# EAGLE design Control_Board (EAGLE 9.4.0)
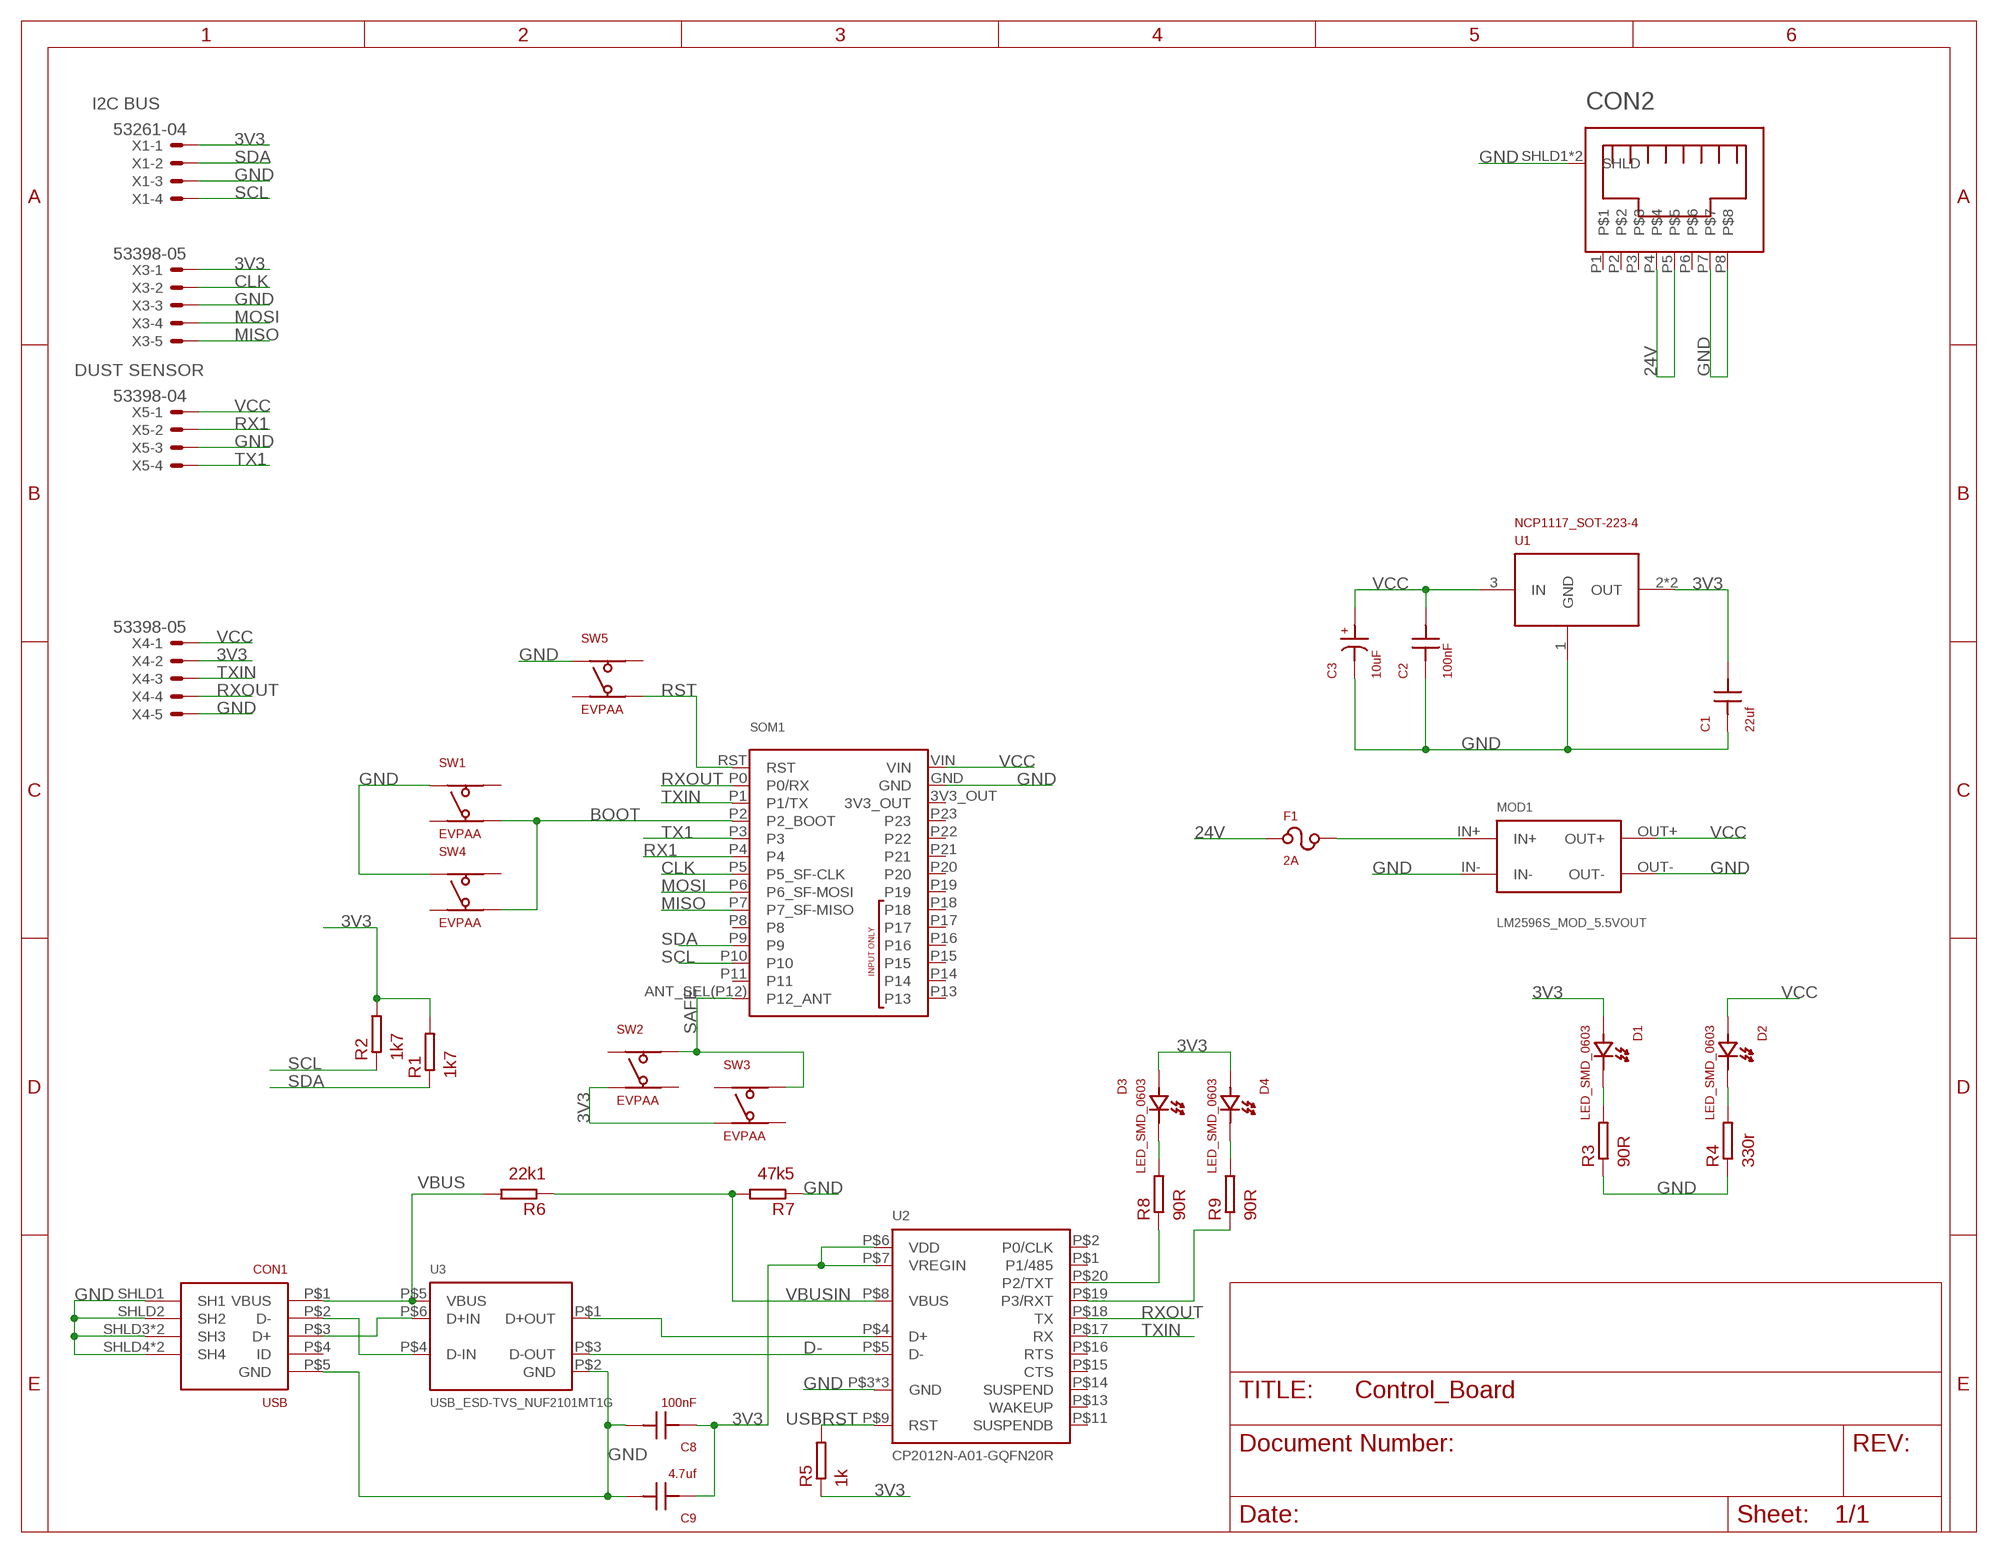
[diagram p0: schematic, sheet 1]

## Parts
C1  22uf  CAP_NP_0603  [SMD_0603]
C2  100nF  CAP_NP_0603  [SMD_0603]
C3  10uF  CAP_POL_SMD_1206  [CAP_POL_1206]
C8  100nF  CAP_NP_0603  [SMD_0603]
C9  4.7uf  CAP_NP_0603  [SMD_0603]
CON1  USB  [USB_MICRO_B_SMD_AMPHENOL]
CON2  P-RJLSE-4X381-01_AMPHENOL  [P-RJLSE-4X381-01_AMPHENOL_SMD_RJ45]
D1  LED_SMD_0603  [LED_SMD_0603]
D2  LED_SMD_0603  [LED_SMD_0603]
D3  LED_SMD_0603  [LED_SMD_0603]
D4  LED_SMD_0603  [LED_SMD_0603]
F1  2A  FUSE_CLIP_SMD_AUTO_MINI_LOWPROF  [FUSE_SMD_AUTO_MINI_LOWPROF]
MOD1  LM2596S_MOD_5.5VOUT  LM2596S-BUCK_CVTR-MODULE  [LM2596S_MODULE]
R1  1k7  RESISTOR_0603  [SMD_0603]
R2  1k7  RESISTOR_0603  [SMD_0603]
R3  90R  RESISTOR_0603  [SMD_0603]
R4  330r  RESISTOR_0603  [SMD_0603]
R5  1k  RESISTOR_0603  [SMD_0603]
R6  22k1  RESISTOR_0603  [SMD_0603]
R7  47k5  RESISTOR_0603  [SMD_0603]
R8  90R  RESISTOR_0603  [SMD_0603]
R9  90R  RESISTOR_0603  [SMD_0603]
SOM1  PYCOM_LOPY4PTH  [PYCOM_LOPY4_PTH]
SW1  EVPAA  SWITCH_MOM_PANA_EVPAA_3.5X2.9  [EVPAA_SWITCH]
SW2  EVPAA  SWITCH_MOM_PANA_EVPAA_3.5X2.9  [EVPAA_SWITCH]
SW3  EVPAA  SWITCH_MOM_PANA_EVPAA_3.5X2.9  [EVPAA_SWITCH]
SW4  EVPAA  SWITCH_MOM_PANA_EVPAA_3.5X2.9  [EVPAA_SWITCH]
SW5  EVPAA  SWITCH_MOM_PANA_EVPAA_3.5X2.9  [EVPAA_SWITCH]
U1  NCP1117_SOT-223-4  [SOT-223]
U2  CP2012N-A01-GQFN20R  [QFN20]
U3  USB_ESD-TVS_NUF2101MT1G  [TSOP-6]
X1  53261-04  [53261-04]
X3  53398-05  [53398-05]
X4  53398-05  [53398-05]
X5  53398-04  [53398-04]

## Nets
3V3: C1.P$2 C8.P$1 C9.P$1 D1.A D3.A D4.A R1.P$2 R2.P$2 R5.P$1 SW2.P$1(A1) SW3.P$1(A1) U1.2(OUT) U1.4(OUT) U2.P$6(VDD) U2.P$7(VREGIN) X1.1 X3.1 X4.2
24V: CON2.P4 CON2.P5 F1.P1A F1.P1B
BOOT: SOM1.P2(P2_BOOT) SW1.P$1'(A2) SW4.P$1'(A2)
CLK: SOM1.P5(P5_SF-CLK) X3.2
D-: U2.P$5(D-) U3.P$3(D-OUT)
GND: C1.P$1 C2.P$1 C3.N C8.P$2 C9.P$2 CON1.P$5(GND) CON1.SHLD1(SH1) CON1.SHLD2(SH2) CON1.SHLD3(SH3) CON1.SHLD4(SH4) CON1.SHLD5(SH3) CON1.SHLD6(SH4) CON2.P7 CON2.P8 CON2.SHLD1(SHLD) CON2.SHLD2(SHLD) MOD1.IN- MOD1.OUT- R3.P$1 R4.P$1 R7.P$1 SOM1.GND SW1.P$2(B1) SW4.P$2(B1) SW5.P$2(B1) U1.1(GND) U2.P$3(GND) U2.P$12(GND) U2.PAD(GND) U3.P$2(GND) X1.3 X3.3 X4.5 X5.3
MISO: SOM1.P7(P7_SF-MISO) X3.5
MOSI: SOM1.P6(P6_SF-MOSI) X3.4
N$1: F1.P2A F1.P2B MOD1.IN+
N$3: CON1.P$3(D+) U3.P$6(D+IN)
N$4: U2.P$4(D+) U3.P$1(D+OUT)
N$5: CON1.P$2(D-) U3.P$4(D-IN)
N$6: D3.K R8.P$2
N$7: D4.K R9.P$2
N$8: R9.P$1 U2.P$19(P3/RXT)
N$9: R8.P$1 U2.P$20(P2/TXT)
N$11: D1.K R3.P$2
N$12: D2.K R4.P$2
RST: SOM1.RST SW5.P$1'(A2)
RX1: SOM1.P4 X5.2
RXOUT: SOM1.P0(P0/RX) U2.P$18(TX) X4.4
SAFE: SOM1.ANT_SEL(P12)(P12_ANT) SW2.P$2'(B2) SW3.P$2'(B2)
SCL: R2.P$1 SOM1.P10 X1.4
SDA: R1.P$1 SOM1.P9 X1.2
TX1: SOM1.P3 X5.4
TXIN: SOM1.P1(P1/TX) U2.P$17(RX) X4.3
USBRST: R5.P$2 U2.P$9(RST)
VBUS: CON1.P$1(VBUS) R6.P$2 U3.P$5(VBUS)
VBUSIN: R6.P$1 R7.P$2 U2.P$8(VBUS)
VCC: C2.P$2 C3.P D2.A MOD1.OUT+ SOM1.VIN U1.3(IN) X4.1 X5.1
Unconnected: CON1.P$4(ID) CON2.P1 CON2.P2 CON2.P3 CON2.P6 SOM1.P8 SOM1.P11 SOM1.P13 SOM1.P14 SOM1.P15 SOM1.P16 SOM1.P17 SOM1.P18 SOM1.P19 SOM1.P20 SOM1.P21 SOM1.P22 SOM1.P23 SW1.P$1(A1) SW1.P$2'(B2) SW2.P$1'(A2) SW2.P$2(B1) SW3.P$1'(A2) SW3.P$2(B1) SW4.P$1(A1) SW4.P$2'(B2) SW5.P$1(A1) SW5.P$2'(B2) U2.P$1(P1/485) U2.P$2(P0/CLK) U2.P$11(SUSPENDB) U2.P$13(WAKEUP) U2.P$14(SUSPEND) U2.P$15(CTS) U2.P$16(RTS)

## Notes on the sheet
- I2C BUS
- DUST SENSOR

## Power pins joined to a net without a drawn wire
3V3_OUT: SOM1.3V3_OUT

## Library data of the parts
C1 C2 C8 C9 = daneagle_db8.0:CAP_NP
C3 = daneagle_db8.0:CAP_POL
CON1 = daneagle_db8.0:USB
CON2 = daneagle_db8.0:P-RJLSE-4X381-01
D1-D4 = daneagle_db8.0:LED
F1 = daneagle_db8.0:FUSE
MOD1 = daneagle_db8.0:LM2596S-BUCK_CVTR-MODULE
R1-R9 = daneagle_db8.0:RESISTOR
SOM1 = daneagle_db8.0:PYCOM_LOPY4
SW1-SW5 = daneagle_db8.0:SWITCH_MOM
U1 = daneagle_db8.0:NCP1117
U2 = daneagle_db8.0:CP2012N
U3 = daneagle_db8.0:USB_ESD-TVS
X1 = con-molex:53?-04: CONNECTOR wire to board 1.25 mm (.049 inch) pitch header; MF: MOLEX; OC_FARNELL: 1125374; OC_NEWARK: unknown
X3 X4 = con-molex:53?-05: CONNECTOR wire to board 1.25 mm (.049 inch) pitch header; MF: MOLEX; OC_FARNELL: 1125354; OC_NEWARK: unknown
X5 = con-molex:53?-04: CONNECTOR wire to board 1.25 mm (.049 inch) pitch header; MF: MOLEX; OC_FARNELL: 1125367; OC_NEWARK: unknown

## Board
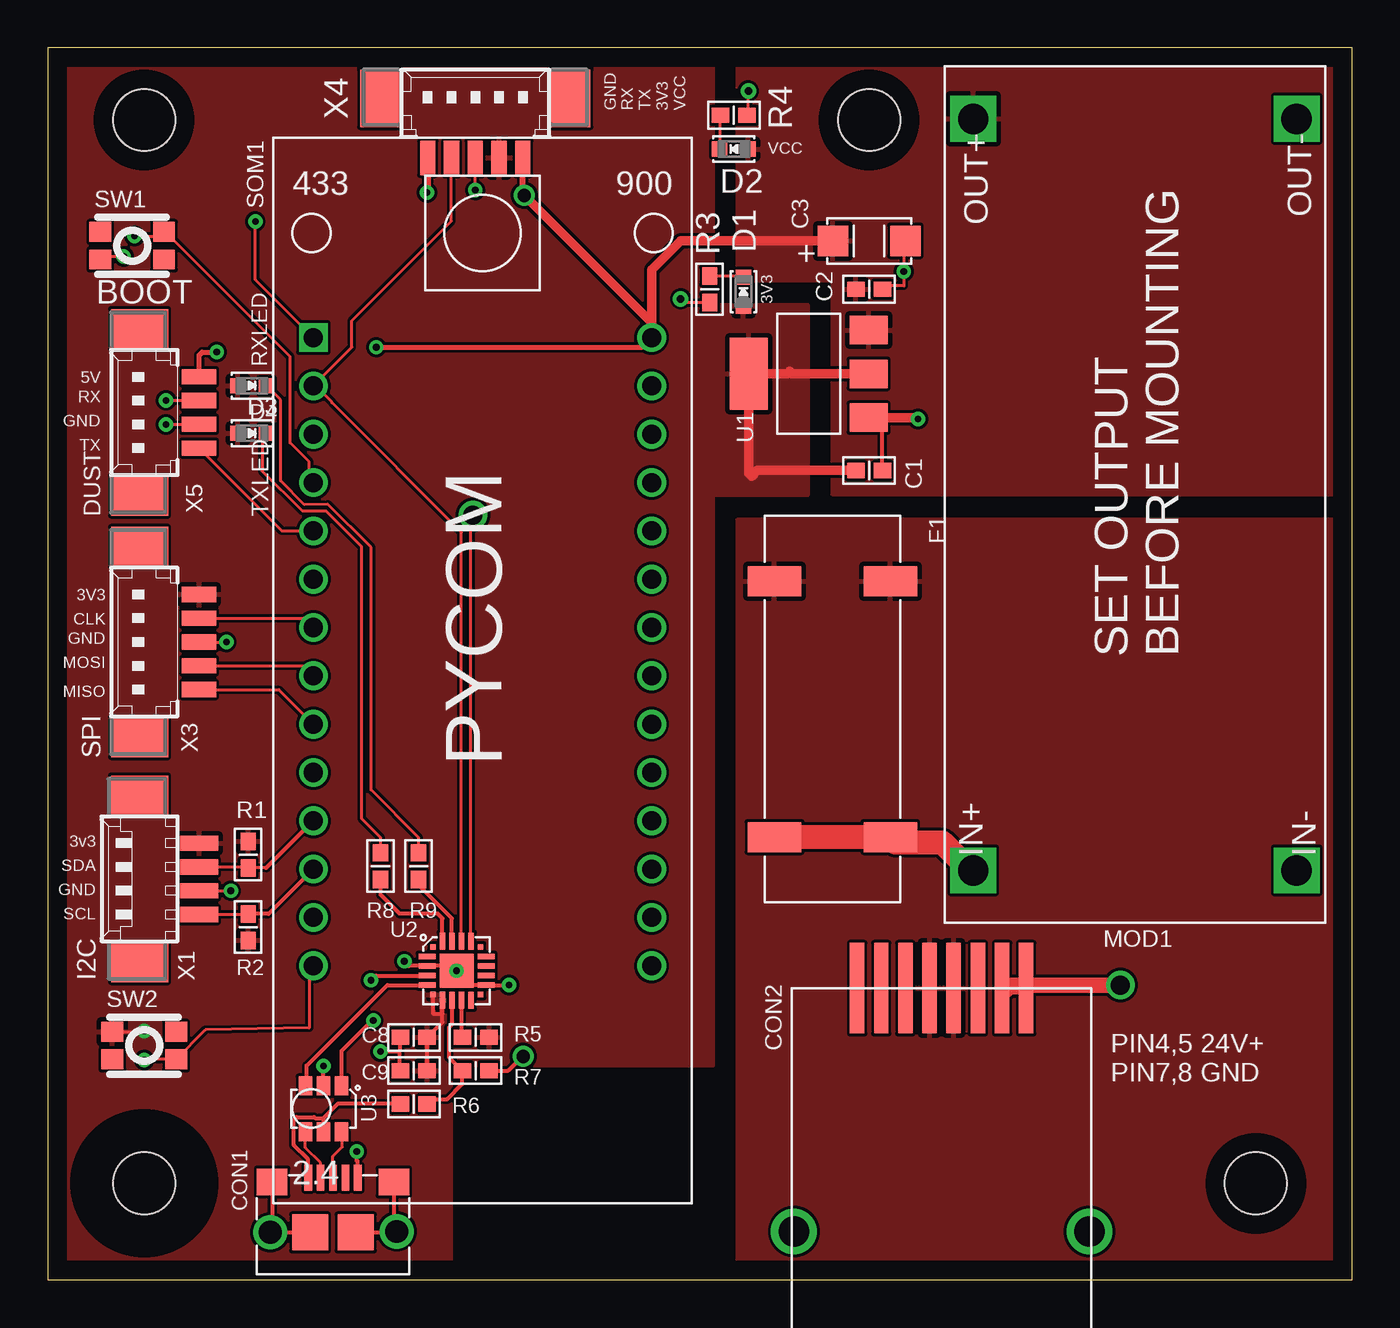
[diagram p1: board, top side]
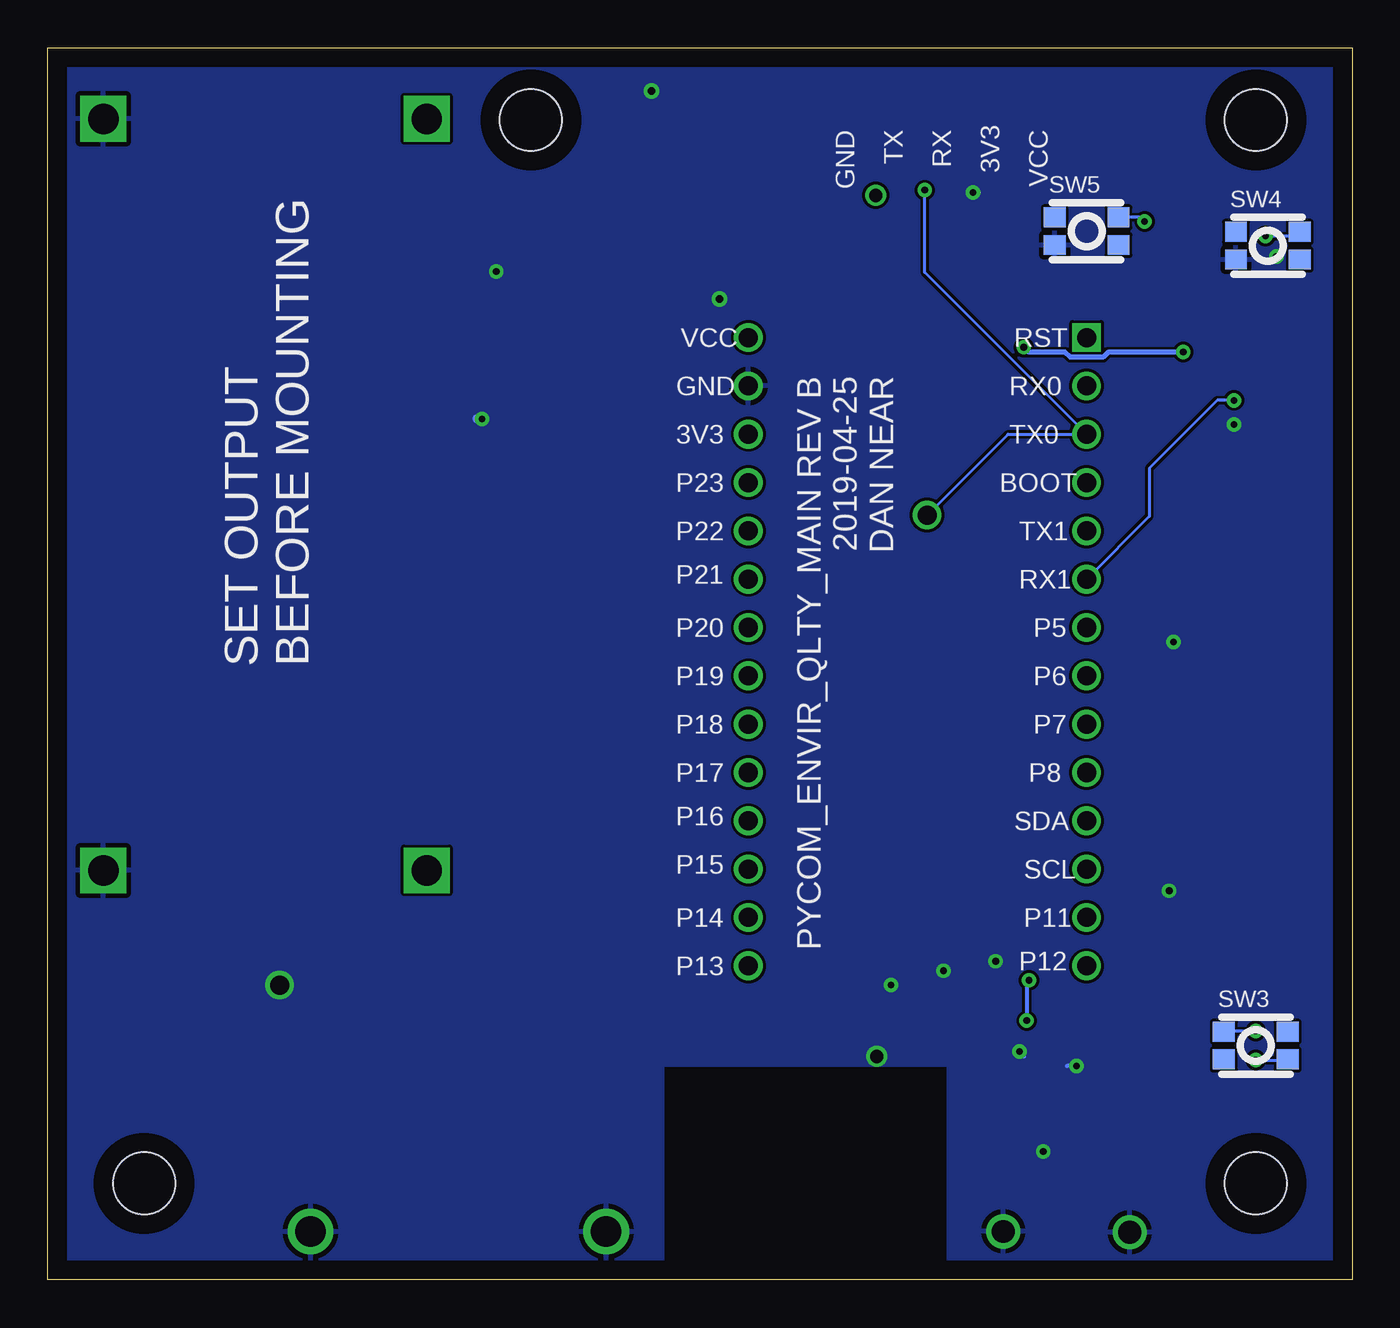
[diagram p2: board, bottom side, seen from below]

Size 68.58 x 64.77 mm. Coordinates in mm from the lower left corner, seen from the top.
Outline: 0,0 68.58,0 68.58,64.77 0,64.77 0,0
Copper layers (1*16): Top 0.035mm / dielectric 1.5mm / Bottom 0.035mm
Design rules "default": minimum track width 6mil, minimum drill 0.35mm, track to track 6mil, track to pad 6mil, pad to pad 6mil, via to via 6mil, smd to smd 6mil, copper to edge 40mil, drill to drill 6mil, minimum pad ring 10mil, minimum via ring 8mil, stop-mask expansion 4mil, vias tented up to drill 0mil, thermal gap 10mil
Holes 3.25 mm at 5.08,5.08 5.08,60.96 63.5,5.08 43.18,60.96
tKeepout: area 60,1.6 to 67,8.6; area 1.6,57.5 to 8.6,64.5; area 39.6,57.5 to 46.6,64.5
tRestrict: area 1.3,1.3 to 8.9,8.9

### Footprints (pad centres in the part's own frame; a part is rotated, then mirrored left to right if it is on the bottom)
SMD_0603 = smd 0.914 x 0.8: P$1 -0.701,0; P$2 0.701,0
CAP_POL_1206 = smd 1.6 x 1.6: N 1.9,0; P -1.9,0
USB_MICRO_B_SMD_AMPHENOL = smd 0.4 x 1.35: P$1 -1.3,2.875; P$2 -0.65,2.875; P$3 0,2.875; P$4 0.65,2.875; P$5 1.3,2.875 | smd 1.9 x 1.9: SHLD1 -1.2,0; SHLD2 1.2,0 | drill 1.2: SHLD3 -3.3,0; SHLD4 3.35,0.05 | smd 1.6 x 1.4: SHLD5 -3.2,2.65; SHLD6 3.2,2.65
P-RJLSE-4X381-01_AMPHENOL_SMD_RJ45 = smd 0.76 x 4.75: P1 -4.445,12.8; P2 -3.175,12.8; P3 -1.905,12.8; P4 -0.635,12.8; P5 0.635,12.8; P6 1.905,12.8; P7 3.175,12.8; P8 4.445,12.8 | drill 1.6: SHLD1 -7.77,0; SHLD2 7.77,0
LED_SMD_0603 = smd 0.8 x 0.8: A 0.75,0; K -0.75,0
FUSE_SMD_AUTO_MINI_LOWPROF = smd 1.575 x 2.819: P1A -6.731,3.048; P1B -6.731,-3.048; P2A 6.731,3.048; P2B 6.731,-3.048
LM2596S_MODULE = drill 1.6 square: IN+ -19.75,8.5; IN- -19.75,-8.5; OUT+ 19.75,8.5; OUT- 19.75,-8.5
PYCOM_LOPY4_PTH = drill 1: 3V3_OUT 8.89,11.43; ANT_SEL(P12) -8.89,-16.51; GND 8.89,13.97; P0 -8.89,13.97; P1 -8.89,11.43; P2 -8.89,8.89; P3 -8.89,6.35; P4 -8.89,3.81; P5 -8.89,1.27; P6 -8.89,-1.27; P7 -8.89,-3.81; P8 -8.89,-6.35; P9 -8.89,-8.89; P10 -8.89,-11.43; P11 -8.89,-13.97; P13 8.89,-16.51; P14 8.89,-13.97; P15 8.89,-11.43; P16 8.89,-8.89; P17 8.89,-6.35; P18 8.89,-3.81; P19 8.89,-1.27; P20 8.89,1.27; P21 8.89,3.81; P22 8.89,6.35; P23 8.89,8.89; VIN 8.89,16.51 | drill 1 square: RST -8.89,16.51
EVPAA_SWITCH = smd 1.15 x 1.05: P$1 -1.675,0.725; P$1' 1.675,0.725; P$2 -1.675,-0.725; P$2' 1.675,-0.725
SOT-223 = smd 1.5 x 2: 1 -2.3,-3.15; 2 0,-3.15; 3 2.3,-3.15 | smd 3.8 x 2: 4 0,3.15
QFN20 = smd 0.3 x 0.3: P$1 -1.25,1.25; P$6 -1.25,-1.25; P$11 1.25,-1.25; P$16 1.25,1.25 | smd 0.9 x 0.3: P$2 -1.55,0.75; P$3 -1.55,0.25; P$4 -1.55,-0.25; P$5 -1.55,-0.75; P$12 1.55,-0.75; P$13 1.55,-0.25; P$14 1.55,0.25; P$15 1.55,0.75 | smd 0.3 x 0.9: P$7 -0.75,-1.55; P$8 -0.25,-1.55; P$9 0.25,-1.55; P$10 0.75,-1.55; P$17 0.75,1.55; P$18 0.25,1.55; P$19 -0.25,1.55; P$20 -0.75,1.55 | smd 1.8 x 1.8: PAD 0,0
TSOP-6 = smd 1 x 0.7: P$1 -1.2,0.95; P$2 -1.2,0; P$3 -1.2,-0.95; P$4 1.2,-0.95; P$5 1.2,0; P$6 1.2,0.95
53261-04 = smd 0.8 x 2: 1 1.875,-2.5; 2 0.625,-2.5; 3 -0.625,-2.5; 4 -1.875,-2.5 | smd 2.1 x 3: S1 4.375,0.625; S2 -4.375,0.625
53398-05 = smd 0.8 x 1.8: 1 2.5,-2.5; 2 1.25,-2.5; 3 0,-2.5; 4 -1.25,-2.5; 5 -2.5,-2.5 | smd 2.1 x 3: S1 5,0.625; S2 -5,0.625
53398-04 = smd 0.8 x 1.8: 1 1.875,-2.5; 2 0.625,-2.5; 3 -0.625,-2.5; 4 -1.875,-2.5 | smd 2.1 x 3: S1 4.375,0.625; S2 -4.375,0.625

### Placement (x,y rotation side)
C1  43.18,42.55 180 top
C2  43.18,52.07 180 top
C3  43.18,54.61 0 top
C8  19.25,12.75 180 top
C9  19.25,11 180 top
CON1  15,2.5 0 top
CON2  46.99,2.54 0 top
D1  36.58,51.94 270 top
D2  36.07,59.44 0 top
D3  10.75,44.5 180 top
D4  10.75,47 180 top
F1  41.25,30 270 top
MOD1  57.15,41.27 90 top
R1  10.54,22.35 90 top
R2  10.54,18.54 270 top
R3  34.8,52.07 90 top
R4  36.07,61.21 180 top
R5  22.5,12.75 180 top
R6  19.25,9.25 180 top
R7  22.5,11 180 top
R8  17.5,21.75 90 top
R9  19.5,21.75 90 top
SOM1  22.86,33.02 0 top
SW1  4.45,54.36 0 top
SW2  5.08,12.32 0 top
SW3  5.08,12.32 0 bottom
SW4  4.45,54.36 0 bottom
SW5  13.97,55.12 0 bottom
U1  40.01,47.62 90 top
U2  21.5,16.25 0 top
U3  14.5,9 270 top
X1  5.46,21.08 90 top
X3  5.46,33.53 90 top
X4  22.48,61.47 0 top
X5  5.46,45.59 90 top

### Tracks (layer width: path | path; a pad name or v marks a point on that pad's centre or on a via)
3V3  (via drill 0.35)
  Top 0.152: 40,47.75 43,47.75 U1.2 | SW2.P$1 5.04,13.04 v5.08,13.08
  Top 0.2: U2.P$6 20.25,14 20.75,14 | 20.75,14 U2.P$7 | 20.75,14 20.75,13.55 C8.P$1 C9.P$1
  Top 0.508: U1.2 39.12,47.62 39,47.75 38.88,47.62 U1.4 36.85,42.4 37,42.25 37.3,42.55 C1.P$2
  Bottom 0.152: v5.08,13.08 6.72,13.08 SW3.P$1
  pour Top: 40,41.25 40,51.25 35,51.25 35,65 0,65 0,0 21.25,0 21.25,11.25 35,11.25 35,41.25
24V
  pour Top: 36.25,0 36.25,40 68.75,40 68.75,0
BOOT  (via drill 0.35)
  Top 0.152: SOM1.P2 13.75,42 13.75,43 12.75,44 12.75,48.53 6.25,55.04 6.12,55.06 SW1.P$1' 5.9,54.86 v4.57,54.86
  Bottom 0.152: SW4.P$1' 2.99,54.86 v4.57,54.86
CLK
  Top 0.152: X3.2 13.48,34.78 SOM1.P5
D-
  Top 0.2: U3.P$3 13.62,10.27 13.62,11.26 17.86,15.5 U2.P$5
GND  (via drill 0.35, 0.4, 0.7, 1)
  Top 0.152: C2.P$1 44,52.25 45,52.25 v45,53 45,54.5 C3.N | 42.75,45 43,45.25 U1.1 43.25,45.25 | 50.25,15.25 CON2.P7 | 51.25,15.25 CON2.P8 51.5,15.5 | 18.25,4.5 CON1.SHLD6 | v4,53.79 3,53.79 2.79,53.61 SW1.P$2 | MOD1.IN- 65.63,21.5 65.5,21.52 | R3.P$1 33.47,51.37 v33.27,51.56 | R4.P$1 36.83,61.27 v36.83,62.48 | X3.3 v9.4,33.53 | X5.3 7.95,44.96 v6.22,44.96 | v9.63,20.45 v9.63,20.46 X1.3
  Top 0.2: U3.P$2 v14.5,11.25 | CON1.P$5 16.3,6.25 16.25,6.25 v16.25,6.75 | CON1.SHLD5 11.8,2.6 CON1.SHLD3 CON1.SHLD1 | CON1.SHLD6 18.2,2.7 CON1.SHLD4 18.3,2.5 CON1.SHLD2 | C8.P$2 18.5,12.7 18.5,12 | 18.5,12 v17.5,12 | C9.P$2 18.5,11.05 18.5,12 | v18.75,16.75 19,16.5 U2.P$3 20.75,16.5 21,16.25 U2.PAD 22.25,15.5 U2.P$12 v24.25,15.5 | R7.P$1 24.2,11 24.95,11.75 v25,11.75 | C1.P$1 43.88,44.62 43.18,45.33
  Top 0.305: X4.5 19.98,57.15 v19.94,57.15
  Top 0.508: 51.25,15.25 50.42,15.25 50.25,15.25 | U1.1 43.18,45.33 45.67,45.33 v45.75,45.25
  Top 0.813: 50.42,15.25 50.66,15.49 v56.39,15.49
  Bottom 0.152: v33.27,51.56 33.53,51.56 | v36.83,62.48 37.08,62.48
  Bottom 0.2: v14.5,11.25 15,11.25 | v16.25,6.75 16.5,6.75 | v17.5,12 17.25,11.75 | v18.75,16.75 18.5,16.75 | v24.25,15.5 24.5,15.5
  Bottom 0.305: v19.94,57.15 19.68,57.15
  Bottom 0.508: v45.75,45.25 46,45.25
  other vias: 21.5,16.25
  pour Bottom: 0,0 21.25,0 21.25,11.25 36.25,11.25 36.25,0 68.75,0 68.75,65 0,65
MISO
  Top 0.152: X3.5 12.15,31.03 SOM1.P7
MOSI
  Top 0.152: X3.4 13.44,32.28 SOM1.P6
N$1
  Top 0.152: 48.49,21.52 MOD1.IN+
  Top 0.508: F1.P2A 44.57,23
  Top 1.27: 48.49,21.52 47.02,23 44.57,23 | F1.P2A F1.P2B
N$3
  Top 0.152: CON1.P$3 15,6.5 15.5,7 15.5,7.75 U3.P$6
N$4  (via drill 0.35)
  Top 0.2: U3.P$1 15.45,12.04 17.04,13.63 v17.12,13.63 | U2.P$4 17.25,16 v17,15.75
  Bottom 0.2: v17,15.75 17.12,15.63 v17.12,13.63
N$5
  Top 0.152: CON1.P$2 14.35,6.15 13.55,6.95 U3.P$4
N$6
  Top 0.152: D3.K 11.27,44.27 11.27,42.51 13.41,40.4 14.63,40.4 16.5,38.54 16.5,24.25 17.5,23.25 R8.P$2
N$7
  Top 0.152: D4.K 12.25,46.25 12.25,42 13.5,40.75 14.74,40.76 17,38.5 17,25.75 19.5,23.25 R9.P$2
N$8
  Top 0.2: U2.P$19 21.25,19 19.5,20.75 R9.P$1
N$9
  Top 0.2: U2.P$20 20.75,19 20.5,19.25 18.5,19.25 17.5,20.25 R8.P$1
N$11
  Top 0.152: R3.P$2 36.5,52.77 D1.K
N$12
  Top 0.152: R4.P$2 35.32,61.16 D2.K
RST  (via drill 0.35)
  Top 0.152: SOM1.RST 10.92,52.58 v10.92,55.63
  Bottom 0.152: v10.92,55.63 11.14,55.84 SW5.P$1'
RX1  (via drill 0.35)
  Top 0.152: X5.2 6.23,46.22 v6.22,46.23
  Bottom 0.152: v6.22,46.23 7.11,46.23 10.67,42.67 10.67,40.13 SOM1.P4
RXOUT
  Top 0.152: U2.P$18 21.75,39.29 14.95,46.09 14.95,46.13 14.09,46.99 SOM1.P0 16,49.02 16,50.42 21.23,55.65 X4.4
SAFE  (via drill 0.35)
  Top 0.152: SOM1.ANT_SEL(P12) 13.75,16.5 13.75,13.25 8.3,13.14 SW2.P$2' 5.12,11.59 v5.08,11.56
  Bottom 0.152: v5.08,11.56 3.44,11.56 SW3.P$2'
SCL
  Top 0.152: 7.88,19.2 7.71,19.2 | 8.13,19.2 8.12,19.21 X1.4 10.51,19.21 R2.P$1
  Top 0.2: 7.88,19.2 8.13,19.2 | SOM1.P10 11.62,19.24 R2.P$1
SDA
  Top 0.152: 7.88,21.7 7.71,21.7 | 8.13,21.7 8.12,21.71 X1.2 10.48,21.71 R1.P$1 11.49,21.65
  Top 0.2: 7.88,21.7 8.13,21.7 | SOM1.P9 11.49,21.65
TX1
  Top 0.152: X5.4 12.31,39.37 SOM1.P3
TXIN  (via drill 0.35, 1)
  Top 0.152: v22.35,40.2 22.29,40.2 22.25,40.16 U2.P$17 | v22.48,57.28 X4.3
  Bottom 0.152: v22.35,40.2 18.1,44.45 SOM1.P1 22.48,52.96 v22.48,57.28
USBRST
  Top 0.2: U2.P$9 21.75,12.8 R5.P$2
VBUS
  Top 0.2: CON1.P$1 13.7,6.33 12.95,7.09 12.95,8.4 13.1,8.55 14.01,8.55 14.06,8.5 14.5,8.5 | 14.5,8.5 U3.P$5 | R6.P$2 15.25,9.25 14.5,8.5
VBUSIN
  Top 0.2: R6.P$1 20.2,9.5 21,9.5 21.8,10.3 R7.P$2 21.09,11.71 21.09,13.26 21.25,13.41 U2.P$8
VCC  (via drill 0.35, 0.7)
  Top 0.254: X5.1 7.96,48.6 8.13,48.77 v8.89,48.77 | v17.27,49.02 31.24,49.02 SOM1.VIN
  Top 0.305: v25.06,57 24.98,57.08 X4.1
  Top 0.508: C3.P 33.27,54.61 31.75,53.09 SOM1.VIN 31.75,50.31 v25.06,57
  Bottom 0.254: v8.89,48.77 12.83,48.77 13.1,48.5 14.84,48.5 15.11,48.77 17.02,48.77 v17.27,49.02
  pour Top: 68.75,41.25 41.25,41.25 41.25,52.5 36.25,52.5 36.25,65 68.75,65

### Text on the board
tPlace: RXLED | TXLED
tNames: GND / RX / TX / 3V3 / VCC | VCC | BOOT | 3V3 | 5V | RX | GND | TX | DUST | 3V3 | CLK | GND | MOSI | SET OUTPUT / BEFORE MOUNTING | MISO | SPI | 3v3 | SDA | GND | SCL | I2C | PIN4,5 24V+ / PIN7,8 GND
bNames: 3V3 | VCC | RX | TX | GND | RST | VCC | PYCOM_ENVIR_QLTY_MAIN REV B / 2019-04-25 / DAN NEAR | RX0 | GND | TX0 | 3V3 | BOOT | P23 | TX1 | P22 | P21 | RX1 | P5 | P20 | SET OUTPUT / BEFORE MOUNTING | P6 | P19 | P7 | P18 | P8 | P17 | SDA | P16 | SCL | P15 | P11 | P14 | P12 | P13
Reference: .2 | 1.7 | 2.7 | 2.55 | 2.4 | .2 | .2 | 2.5